# Altium schematic sheet Sheet1.SchDoc: cfgbhnjkb
size 420 x 297 mm; SheetNumber: 1; SheetTotal: 1
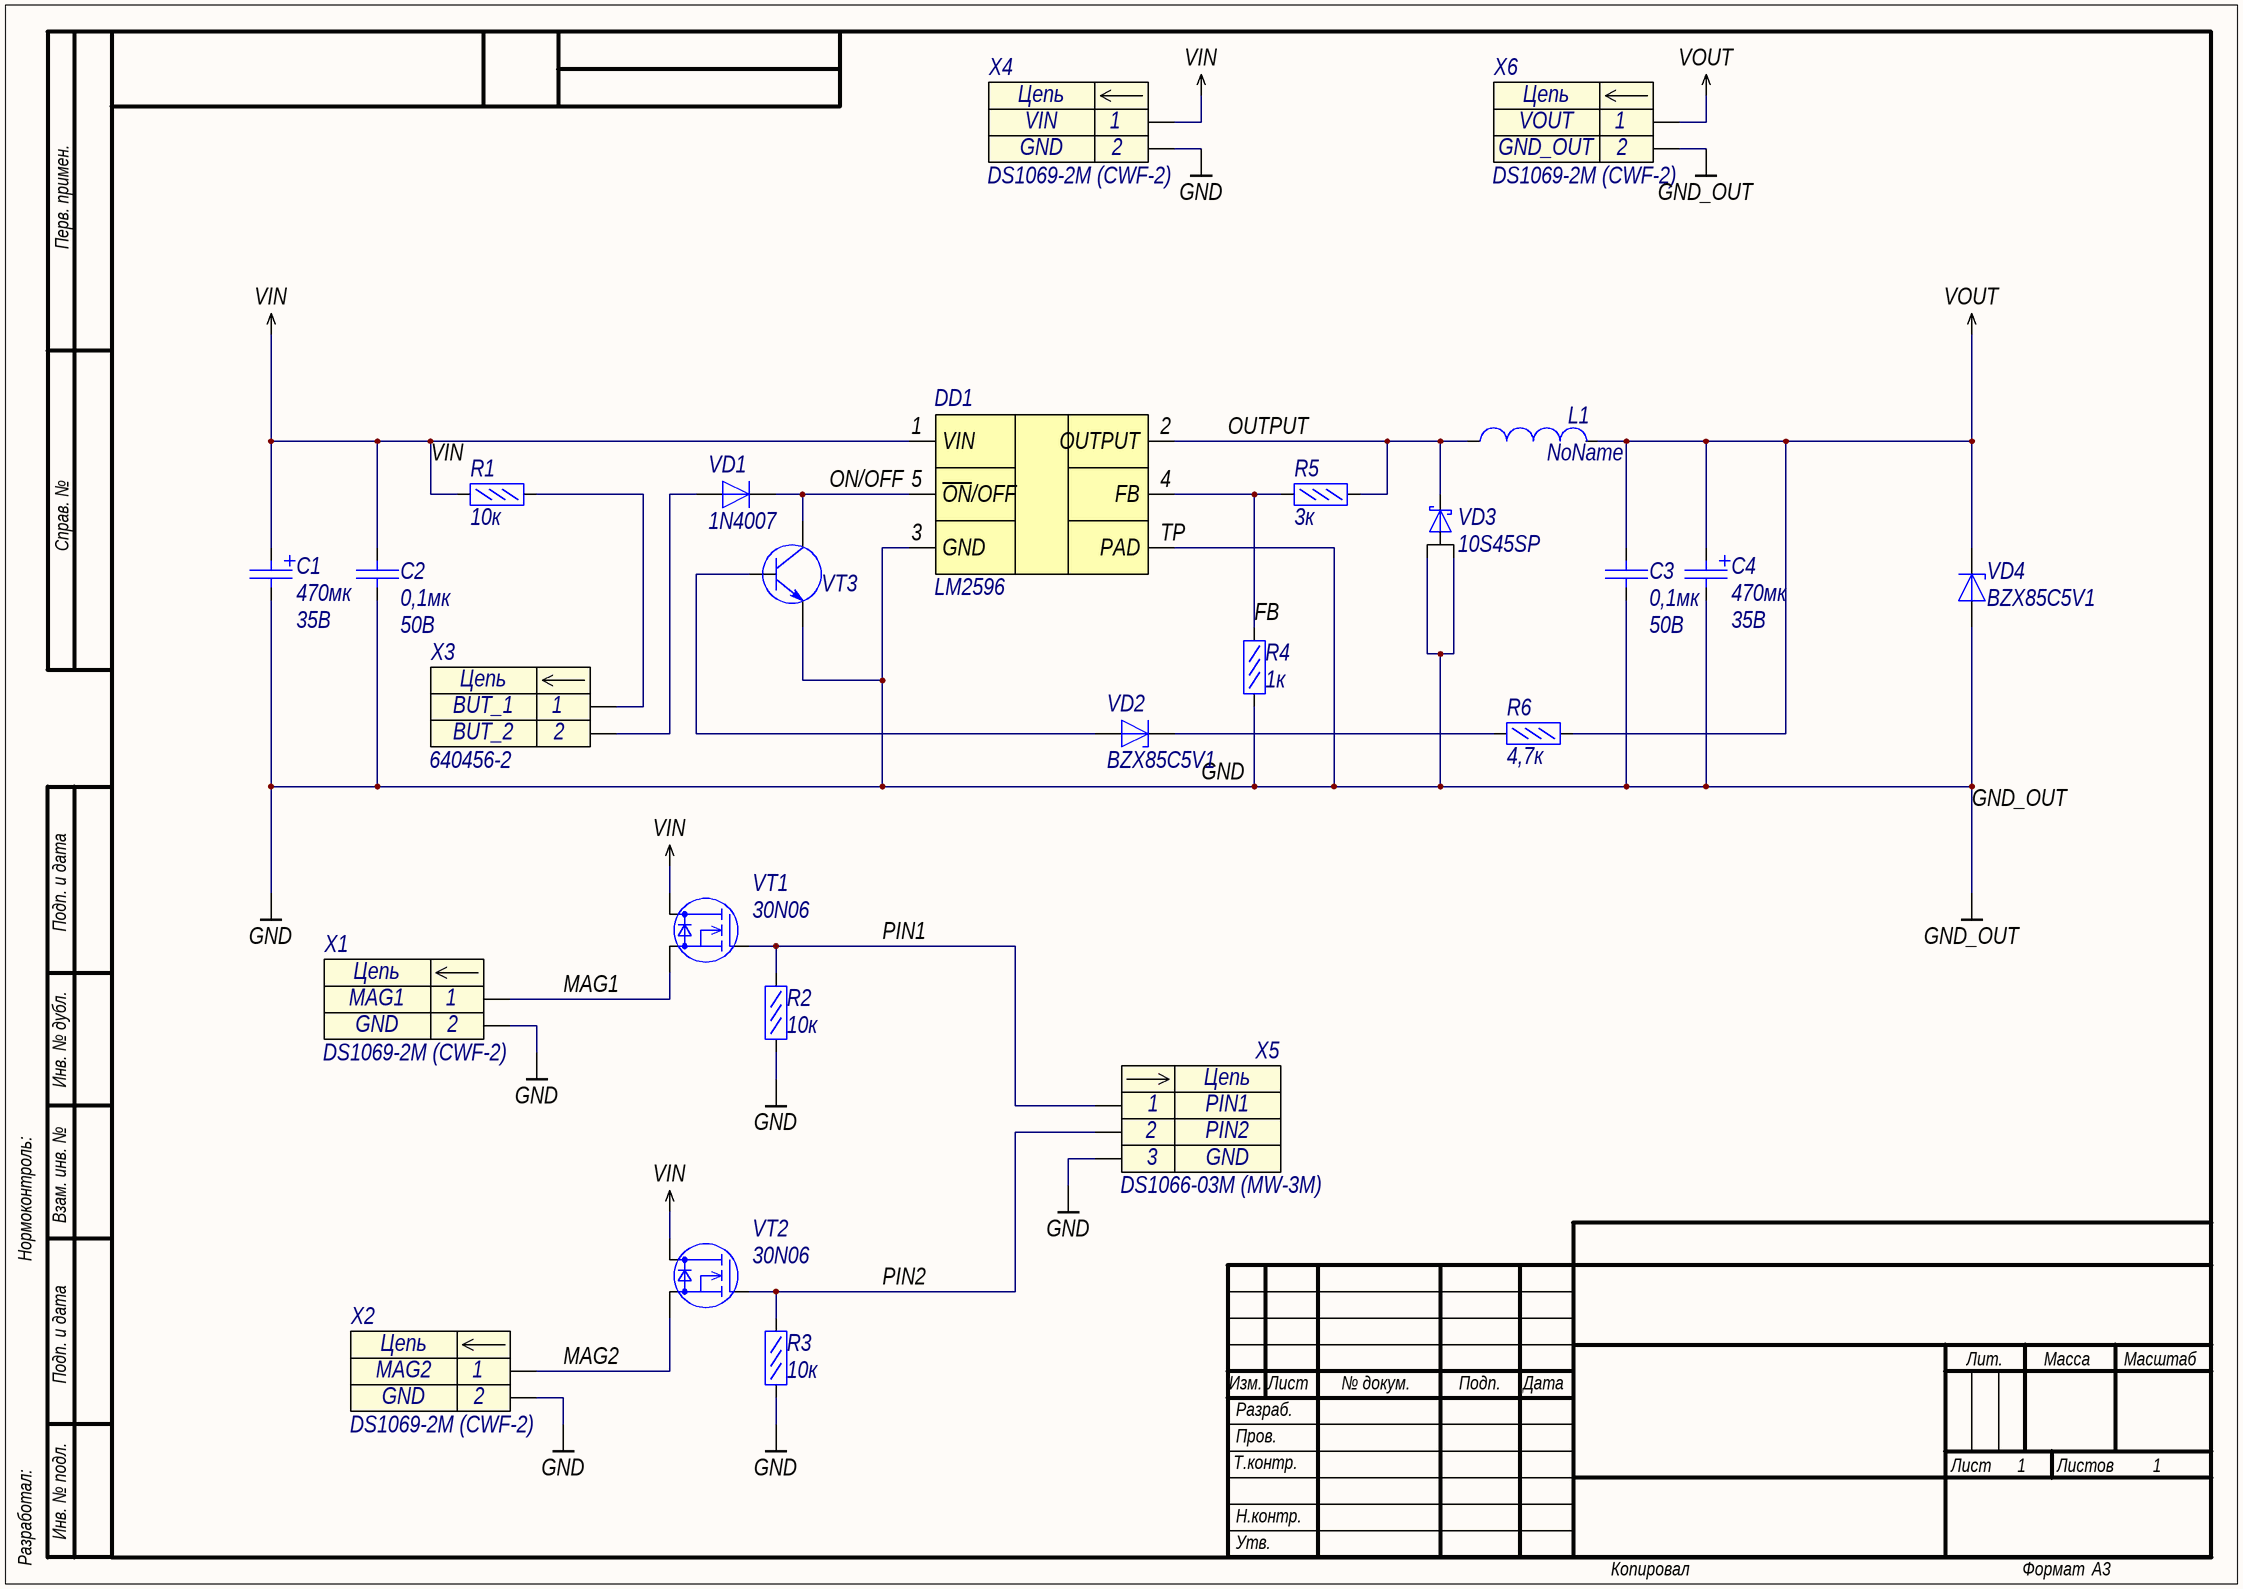
[diagram p0: Sheet1.SchDoc]

## Parts
C1  Voltage: 35В  [CAPALUM_10x12.5]  (hidden comment: 470мк)
C2  Voltage: 50В  [C0603]  (hidden comment: 0,1мк)
C3  Voltage: 50В  [C0603]  (hidden comment: 0,1мк)
C4  Voltage: 35В  [CAPALUM_10x12.5]  (hidden comment: 470мк)
DD1  LM2596  [D2PAK_5]
L1  NoName  [CDRH124]
R1  10к  [R0603]
R2  10к  [R0603]
R3  10к  [R0603]
R4  1к  [R0603]
R5  3к  [R0603]
R6  4,7к  [R0603]
VD1  1N4007  [DO-41 VERTICAL]
VD2  BZX85C5V1  [DO-41 VERTICAL]
VD3  10S45SP  [TO-277A]
VD4  BZX85C5V1  [DO-41 VERTICAL]
VT1  30N06  [D-PAK]
VT2  30N06  [D-PAK]
VT3  BC847B  [SOT23-3]  (value not drawn)
X1  DS1069-2M (CWF-2)  [CWF-2]
X2  DS1069-2M (CWF-2)  [CWF-2]
X3  640456-2  [JST-640456-2]
X4  DS1069-2M (CWF-2)  [CWF-2]
X5  DS1066-03M (MW-3M)  [MW-3M]
X6  DS1069-2M (CWF-2)  [CWF-2]

## Nets
GND: C1.2 C2.1 C3.1 C4.2 DD1.3(GND) DD1.TP(PAD) R2.1 R3.1 R4.1 VD3.1(A) VD3.2(A) VD4.1(A) VT3.2 X1.2 X2.2 X4.2 X5.3 X6.2  [also labelled GND_OUT]
VIN: C1.1 C2.2 DD1.1(VIN) R1.1 VT1.3(D) VT2.3(D) X4.1
VOUT: C3.2 C4.1 L1.2 R6.2 VD4.2(K) X6.1
FB: DD1.4(FB) R4.2 R5.1
MAG1: VT1.2(S) X1.1
MAG2: VT2.2(S) X2.1
ON/OFF: DD1.5(~{ON}/OFF) VD1.2(K) VT3.3
OUTPUT: DD1.2(OUTPUT) L1.1 R5.2 VD3.3(K)
PIN1: R2.2 VT1.1(G) X5.1
PIN2: R3.2 VT2.1(G) X5.2
NetR1_2: R1.2 X3.1
NetR6_1: R6.1 VD2.2(K)
NetVD1_1: VD1.1(A) X3.2
NetVD2_1: VD2.1(A) VT3.1

## Notes on the sheet
- Перв. примен.
- Справ. №
- Подп. и дата
- Инв. № дубл.
- Нормоконтроль:
- Взам. инв. №
- Изм.
- Лист
- № докум.
- Подп.
- Дата
- Лит.
- Масса
- Масштаб
- Т.контр.
- Пров.
- Разраб.
- Листов
- Разработал:
- Инв. № подл.
- Н.контр.
- Утв.
- Копировал
- Формат
- А3
- (in symbol CWF-2) Цепь
- (in symbol JST-640456-2) Цепь
- (in symbol MW-3M) Цепь

## Library data of the parts
C1 C4 = SH035M0470B5s-1015: Конденсатор эл.лит. алюм. 470мкФ 35В; Manufacturer: EPCOS; Name: B41858C6157M; ESR: 0,3Ом; Value: 470мк
C2 C3 = CC0603JPX7R9BB104: Конденсатор кер. 0,1мкФ 50В; Manufacturer: Yageo; TKE: X7R; Name: CC0603JPX7R9BB104; Value: 0,1мк
DD1 = LM2596: регулируемый стабилизатор напряжения; Name: LM2596
L1 = NoName: Катушка с сердечником 47мкГн 0,8А; Name: CDRH124NP-4R7MC; Value: 47мк; I saturation: 5,7А; R: 0,014
R1-R3 = RC0603FR-0710KL: Резистор 10кОм 0,063Вт 1%; Manufacturer: YAGEO; Name: RC0603FR-0710KL; Tolerance: 1%; Value: 10к
R4 = RC0603FR-071KL: Резистор 1кОм 0,063Вт 1%; Manufacturer: YAGEO; Name: RC0603FR-071KL; Tolerance: 1%; Value: 1к
R5 = RC0603FR-073KL: Резистор 3кОм 0,063Вт 1%; Manufacturer: YAGEO; Name: RC0603FR-073KL; Tolerance: 1%; Value: 3к
R6 = RC0603FR-074K7L: Резистор 4,7кОм 0,063Вт 1%; Manufacturer: YAGEO; Name: RC0603FR-074K7L; Tolerance: 1%; Value: 4,7к
VD1 = 1N4007: Диод выпрямиельный 1000В 1А; Name: 1N4007
VD2 VD4 = BZX85C5V1: Стабилитрон 5,1В; Name: BZX85C5V1
VD3 = 10S45SP: Диод Шоттки 45В 10А; Manufacturer: YFW; Name: 10S45SP
VT1 VT2 = 30N06: N-MOSFET 60В 30А; Manufacturer: UMW Youtai Semiconductor; Name: 30N06
VT3 = BC847B: Биполярный NPN транзистор 45В 100мА; Manufacturer: NXP Semiconductor; Name: BC847B
X1 = CWF-2: Разъем - 2 конт. прямая вилка на плату; Contact_1: MAG1; Contact_2: GND; Name: DS1069-2M (CWF-2)
X2 = CWF-2: Разъем - 2 конт. прямая вилка на плату; Contact_1: MAG2; Contact_2: GND; Name: DS1069-2M (CWF-2)
X3 = JST-640456-2: Разъем - 2 конт. прямая вилка на плату; Contact_1: BUT_1; Contact_2: BUT_2; Name: 640456-2
X4 = CWF-2: Разъем - 2 конт. прямая вилка на плату; Contact_1: VIN; Contact_2: GND; Name: DS1069-2M (CWF-2)
X5 = MW-3M: Разъем - 3 конт. прямая вилка на плату; Contact_1: PIN1; Contact_2: PIN2; Contact_3: GND; Name: DS1066-03M (MW-3M)
X6 = CWF-2: Разъем - 2 конт. прямая вилка на плату; Contact_1: VOUT; Contact_2: GND_OUT; Name: DS1069-2M (CWF-2)